# Altium project Key.PrjPCB
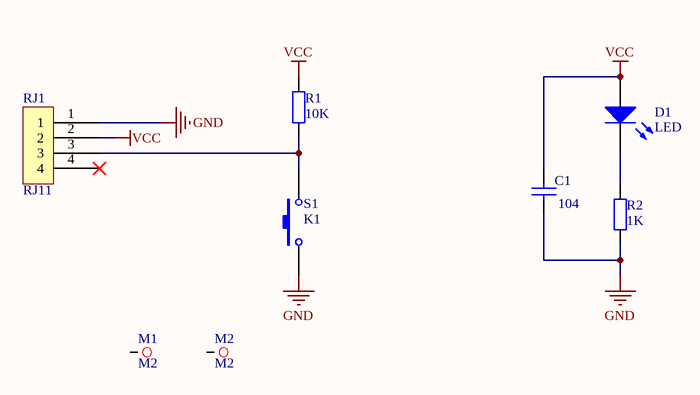
[diagram p0: Key.SchDoc]
1 sheet, 8 parts. Net scope: global (net labels, ports and power ports of the same name join across sheets).
Board file: Key.PcbDoc

## Sheet Key.SchDoc
size A4

### Parts
C1  value 104  [0603_C]  (hidden comment: Cap)
D1  LED  [0805]
M1  M2  [M2]
M2  M2  [M2]
R1  value 10K  [0603_R]  (hidden comment: Res2)
R2  value 1K  [0603_R]  (hidden comment: Res2)
RJ1  RJ11  [RJ11]
S1  K1  [Key-12*12*7.3]

### Nets
GND: C1.1 R2.1 RJ1.1 S1.1
VCC: C1.2 D1.1(A) R1.1 RJ1.2
NetD1_2: D1.2(K) R2.2
NetR1_2: R1.2 RJ1.3 S1.2

Not connected (* = marked no-connect by the designer): M1 0; M2 0; RJ1 4*

### Library data of the parts
C1 = Cap: Capacitor; Published: 8-Jun-2000; LatestRevisionDate: 17-Jul-2002; LatestRevisionNote: Re-released for DXP Platform.; PackageReference: RAD-0.3; Publisher: Altium Limited
D1 = LED1: Typical RED GaAs LED; Published: 8-Jun-2000; LatestRevisionDate: 08-Jul-2005; LatestRevisionNote: Mech Layer 1 removed.; PackageReference: LED-1; Publisher: Altium Limited
M1 M2 = M3
R1 R2 = Res2: Resistor; Published: 8-Jun-2000; LatestRevisionDate: 17-Jul-2002; LatestRevisionNote: Re-released for DXP Platform.; PackageReference: AXIAL-0.4; Publisher: Altium Limited
S1 = SW-PB: Switch; Published: 24-Mar-1999; LatestRevisionDate: 17-Jul-2002; LatestRevisionNote: Re-released for DXP Platform.; PackageReference: SPST-2; Publisher: Altium Limited